# EAGLE design main (EAGLE 6.2)
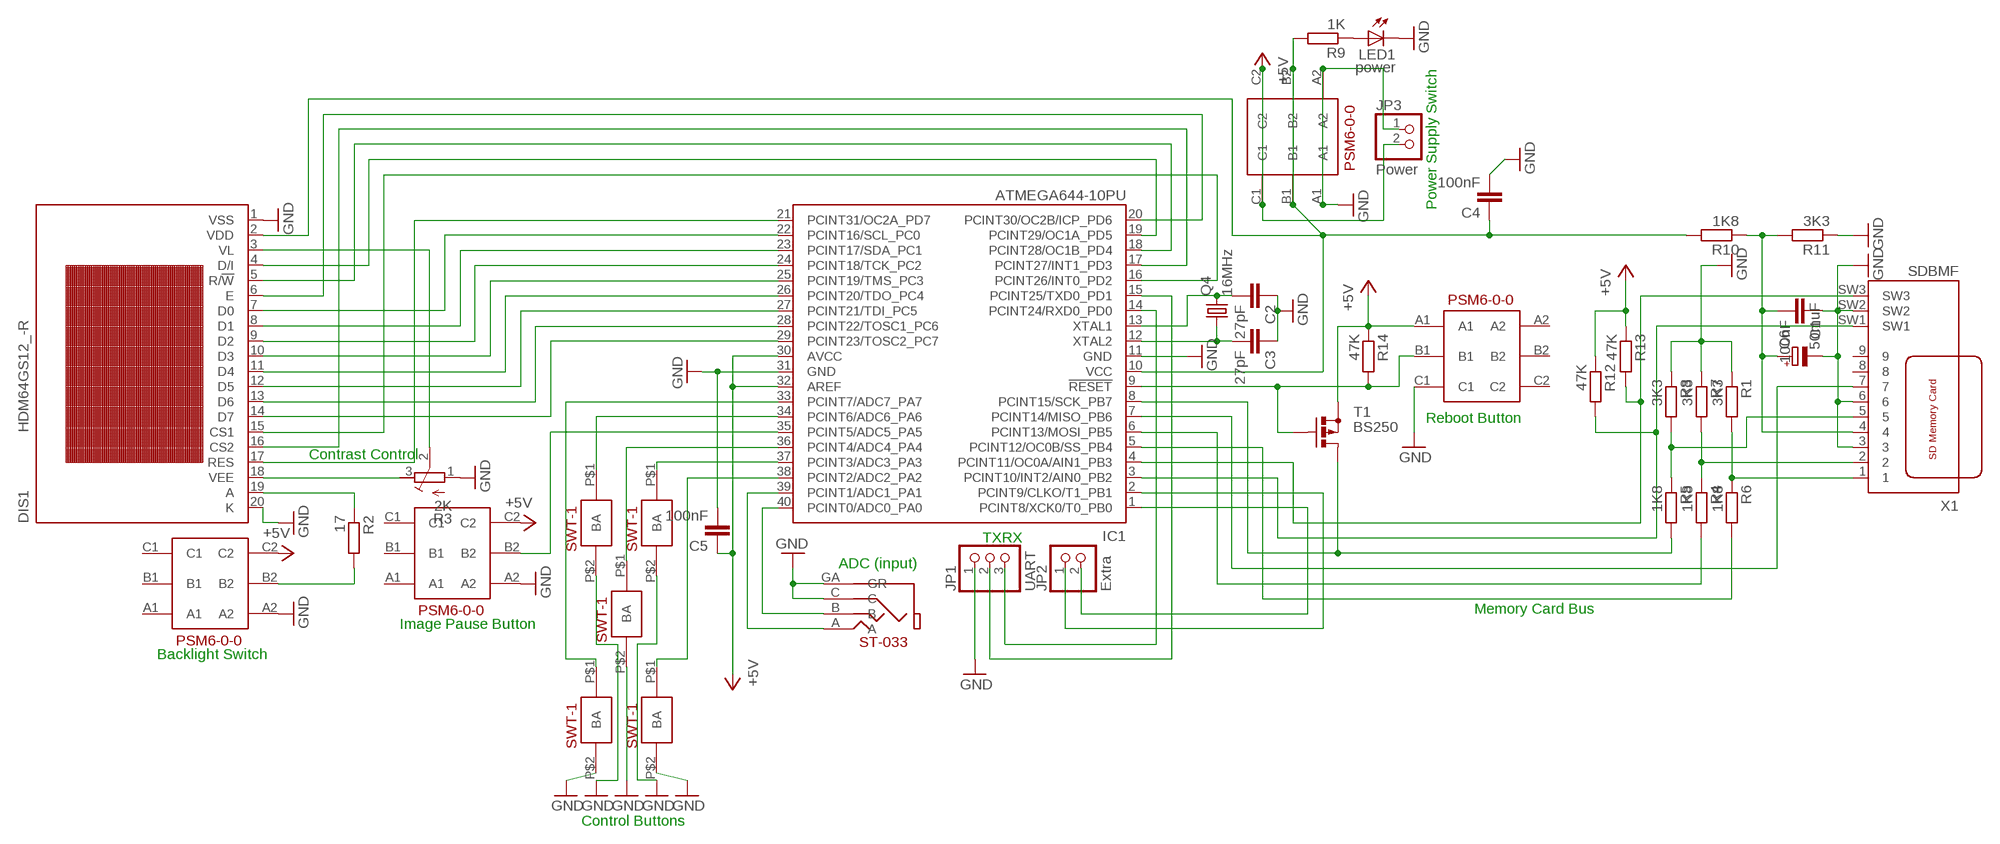
[diagram p0: schematic, sheet 1]

## Parts
C1  100nF  C-EU050-075X075  [C050-075X075]
C2  27pF  C-EU050-075X075  [C050-075X075]
C3  27pF  C-EU050-075X075  [C050-075X075]
C4  100nF  C-EU050-075X075  [C050-075X075]
C5  100nF  C-EU050-075X075  [C050-075X075]
C6  50muF  CPOL-EUE5-13  [E5-13]
DIS1  HDM64GS12_-R  [HDM64GS12_-R]
IC1  ATMEGA644-10PU  [DIL40]
JP1  UART  PINHD-1X3  [1X03]
JP2  Extra  PINHD-1X2  [1X02]
JP3  Power  PINHD-1X2  [1X02]
LED1  power  LED3MM  [LED3MM]
Q4  16MHz  CRYSTALHC49U-V  [HC49U-V]
R1  3K3  R-EU_0204/7  [0204/7]
R2  17  R-EU_0817/22  [P0817/22]
R3  2K  R-TRIMM4G/J  [RTRIM4G/J]
R4  1K8  R-EU_0204/7  [0204/7]
R5  1K8  R-EU_0204/7  [0204/7]
R6  1K8  R-EU_0204/7  [0204/7]
R7  3K3  R-EU_0204/7  [0204/7]
R8  3K3  R-EU_0204/7  [0204/7]
R9  1K  R-EU_0204/7  [0204/7]
R10  1K8  R-EU_0204/7  [0204/7]
R11  3K3  R-EU_0204/7  [0204/7]
R12  47K  R-EU_0204/7  [0204/7]
R13  47K  R-EU_0204/7  [0204/7]
R14  47K  R-EU_0204/7  [0204/7]
T1  BS250  [SOT54E]
U$1_TOP  TOP  SWT-1  [SWT-1]
U$2_RIGHT  RIGHT  SWT-1  [SWT-1]
U$3_LEFT  LEFT  SWT-1  [SWT-1]
U$4_BOTTOM  BOTTOM  SWT-1  [SWT-1]
U$5_CENTER  CENTER  SWT-1  [SWT-1]
U$6_BACKLIGHT  pause  PSM6-0-0  [PSM6-0-0]
U$6_PAUSE  pause  PSM6-0-0  [PSM6-0-0]
U$7_POWER  power  PSM6-0-0  [PSM6-0-0]
U$8_REBOOT  reboot  PSM6-0-0  [PSM6-0-0]
U$11  ST-033  [ST-033]
X1  SDBMF  [SDBMF-009XXBXX2]

## Nets
+5V: C5.1 IC1.30(AVCC) IC1.32(AREF) JP3.2 R12.1 R13.1 R14.1 T1.S U$6_BACKLIGHT.C2 U$6_PAUSE.C2 U$7_POWER.C1 U$7_POWER.C2 U$8_REBOOT.A1
GND: C1.1 C2.1 C3.1 C4.2 C5.2 C6.- DIS1.1(VSS) DIS1.20(K) IC1.11(GND) IC1.31(GND) JP1.1 JP3.1 LED1.K(C) R1.1 R3.1(E) R7.1 R8.1 R11.1 U$1_TOP.P$2(B) U$2_RIGHT.P$2(B) U$3_LEFT.P$2(B) U$4_BOTTOM.P$2(B) U$5_CENTER.P$2(B) U$6_BACKLIGHT.A2 U$6_PAUSE.A2 U$7_POWER.A1 U$7_POWER.A2 U$8_REBOOT.C1 U$11.C U$11.GA(GR) X1.3 X1.6 X1.SW2
N$1: DIS1.13(D6) IC1.28(PCINT22/TOSC1_PC6)
N$2: C2.2 IC1.13(XTAL1) Q4.2
N$3: DIS1.8(D1) IC1.23(PCINT17/SDA_PC1)
N$4: DIS1.9(D2) IC1.24(PCINT18/TCK_PC2)
N$5: DIS1.10(D3) IC1.25(PCINT19/TMS_PC3)
N$6: DIS1.11(D4) IC1.26(PCINT20/TDO_PC4)
N$7: DIS1.12(D5) IC1.27(PCINT21/TDI_PC5)
N$8: IC1.36(PCINT4/ADC4_PA4) U$3_LEFT.P$1(A)
N$9: DIS1.14(D7) IC1.29(PCINT23/TOSC2_PC7)
N$10: IC1.5(PCINT12/OC0B/SS_PB4) R6.2
N$11: DIS1.3(VL) R3.2(S)
N$12: DIS1.19(A) R2.1
N$13: LED1.A R9.1
N$14: DIS1.16(CS2) IC1.17(PCINT27/INT1_PD3)
N$15: DIS1.5(R/!W) IC1.18(PCINT28/OC1B_PD4)
N$16: DIS1.4(D/I) IC1.19(PCINT29/OC1A_PD5)
N$17: DIS1.15(CS1) IC1.16(PCINT26/INT0_PD2)
N$18: DIS1.17(RES) IC1.21(PCINT31/OC2A_PD7)
N$19: IC1.6(PCINT13/MOSI_PB5) R4.2
N$20: DIS1.6(E) IC1.20(PCINT30/OC2B/ICP_PD6)
N$21: IC1.4(PCINT11/OC0A/AIN1_PB3) R13.2 X1.SW3
N$22: R1.2 R6.1 X1.1
N$23: R4.1 R7.2 X1.2
N$24: R5.1 R8.2 X1.5
N$25: IC1.39(PCINT1/ADC1_PA1) U$11.A
N$26: DIS1.7(D0) IC1.22(PCINT16/SCL_PC0)
N$27: IC1.9(!RESET) R14.2 T1.G U$8_REBOOT.B1
N$28: C3.2 IC1.12(XTAL2) Q4.1
N$29: IC1.34(PCINT6/ADC6_PA6) U$1_TOP.P$1(A)
N$30: IC1.37(PCINT3/ADC3_PA3) U$2_RIGHT.P$1(A)
N$31: IC1.15(PCINT25/TXD0_PD1) JP1.2
N$32: IC1.33(PCINT7/ADC7_PA7) U$4_BOTTOM.P$1(A)
N$33: IC1.38(PCINT2/ADC2_PA2) U$5_CENTER.P$1(A)
N$34: IC1.40(PCINT0/ADC0_PA0) U$11.B
N$35: IC1.14(PCINT24/RXD0_PD0) JP1.3
N$36: IC1.35(PCINT5/ADC5_PA5) U$6_PAUSE.B2
N$37: DIS1.18(VEE) R3.3(A)
N$38: C1.2 C6.+ R10.1 R11.2 X1.4
N$39: IC1.7(PCINT14/MISO_PB6) X1.7
N$41: IC1.3(PCINT10/INT2/AIN0_PB2) R12.2 X1.SW1
N$42: R2.2 U$6_BACKLIGHT.B2
N$44: C4.1 DIS1.2(VDD) IC1.10(VCC) R9.2 R10.2 U$7_POWER.B1 U$7_POWER.B2
N$46: IC1.8(PCINT15/SCK_PB7) R5.2 T1.D
N$47: IC1.2(PCINT9/CLKO/T1_PB1) JP2.1
N$49: IC1.1(PCINT8/XCK0/T0_PB0) JP2.2
Unconnected: U$6_BACKLIGHT.A1 U$6_BACKLIGHT.B1 U$6_BACKLIGHT.C1 U$6_PAUSE.A1 U$6_PAUSE.B1 U$6_PAUSE.C1 U$8_REBOOT.A2 U$8_REBOOT.B2 U$8_REBOOT.C2 X1.8 X1.9

## Notes on the sheet
- Power Supply Switch
- Reboot Button
- Contrast Control
- TX | RX
- ADC (input)
- Memory Card Bus
- Image Pause Button
- Backlight Switch
- Control Buttons

## Library data of the parts
C1-C5 = resistor:C-EU: CAPACITOR, European symbol
C6 = resistor:CPOL-EU: POLARIZED CAPACITOR, European symbol
DIS1 = display-lcd:HDM64GS12_-R: HDM64GS12_-R 128 X 64 Dots Graphic Source: http://www.hantronix.com/down/64gs12-r.pdf; OC_FARNELL: unknown; OC_NEWARK: unknown
IC1 = atmel:ATMEGA644-*PU: 8-bit Microcontroller with 64K Bytes In-System Programmable Flash Auto generated by make-symbol-device-package-bsdl.ulp Rev. 34 Source: http://www.atmel.com/dyn/resources/prod_documents/doc2593.pdf; MPN: ATMEGA644V-10PU; OC_FARNELL: 1288342; OC_NEWARK: 23M5062
JP1 = pinhead:PINHD-1X3: PIN HEADER
JP2 JP3 = pinhead:PINHD-1X2: PIN HEADER
LED1 = led:LED: LED OSRAM: - CHIPLED LG R971, LG N971, LY N971, LG Q971, LY Q971, LO R971, LY R971 LH N974, LH R974 LS Q976, LO Q976, LY Q976 LO Q996 - Hyper CHIPLED LW Q18S LB Q993, LB Q99A, LB R99A - SideLED LS A670, LO A670, LY A670, LG A670, LP A670 LB A673, LV A673, LT A673, LW A673 LH A674 LY A675 LS A676, LA A676, LO A676, LY A676, LW A676 LS A679, LY A679, LG A679 - Hyper Micro SIDELED® LS Y876, LA Y876, LO Y876, LY Y876 LT Y87S - SmartLED LW L88C, LW L88S LB L89C, LB L89S, LG L890 LS L89K, LO L89K, LY L89K LS L896, LA L896, LO L896, LY L896 - TOPLED LS T670, LO T670, LY T670, LG T670, LP T670 LSG T670, LSP T670, LSY T670, LOP T670, LYG T670 LG T671, LOG T671, LSG T671 LB T673, LV T673, LT T673, LW T673 LH T674 LS T676, LA T676, LO T676, LY T676, LB T676, LH T676, LSB T676, LW T676 LB T67C, LV T67C, LT T67C, LS T67K, LO T67K, LY T67K, LW E67C LS E67B, LA E67B, LO E67B, LY E67B, LB E67C, LV E67C, LT E67C LW T67C LS T679, LY T679, LG T679 LS T770, LO T770, LY T770, LG T770, LP T770 LB T773, LV T773, LT T773, LW T773 LH T774 LS E675, LA E675, LY E675, LS T675 LS T776, LA T776, LO T776, LY T776, LB T776 LHGB T686 LT T68C, LB T68C - Hyper Mini TOPLED® LB M676 - Mini TOPLED Santana® LG M470 LS M47K, LO M47K, LY M47K Source: http://www.osram.convergy.de LUXEON: - LUMILED® LXK2-PW12-R00, LXK2-PW12-S00, LXK2-PW14-U00, LXK2-PW14-V00 LXK2-PM12-R00, LXK2-PM12-S00, LXK2-PM14-U00 LXK2-PE12-Q00, LXK2-PE12-R00, LXK2-PE12-S00, LXK2-PE14-T00, LXK2-PE14-U00 LXK2-PB12-K00, LXK2-PB12-L00, LXK2-PB12-M00, LXK2-PB14-N00, LXK2-PB14-P00, LXK2-PB14-Q00 LXK2-PR12-L00, LXK2-PR12-M00, LXK2-PR14-Q00, LXK2-PR14-R00 LXK2-PD12-Q00, LXK2-PD12-R00, LXK2-PD12-S00 LXK2-PH12-R00, LXK2-PH12-S00 LXK2-PL12-P00, LXK2-PL12-Q00, LXK2-PL12-R00 Source: www.luxeon.com KINGBRIGHT: KA-3528ASYC Source: www.kingbright.com
Q4 = crystal:CRYSTAL: CRYSTAL; OC_FARNELL: 1666969; OC_NEWARK: unknown
R1 R2 R4-R14 = resistor:R-EU_: RESISTOR, European symbol
R3 = resistor:R-TRIMM: Trimm resistor
T1 = transistor-small-signal:BS250: P-CHANNEL MOS FET
U$1_TOP U$2_RIGHT U$3_LEFT U$4_BOTTOM U$5_CENTER = SWT-1:SWT-1: SWT-1: Tact button, type 3. Electrical Characteristics: Operating Range: 12V, 50mA; Withstand voltage: 500V AC 1 min in TECH; The resistance of the insulator: At least 100 MW; Contact resistance: less than 0.1 ohm; performance Specifications; Number of cycles: 50 000
U$6_BACKLIGHT U$6_PAUSE U$7_POWER U$8_REBOOT = PSM6-0-0:PSM6-0-0: Electrical Characteristics: Operating current: 0.1A; Operating voltage: 12V; The resistance of the insulator: At least 100MoM; Contact resistance: 0.03 cM; Withstand voltage: 500V AC 1 min in TECH; performance Specifications: Number of cycles: at least 50,000;
U$11 = ST-033:ST-033
X1 = farnell:SDBMF: SD MEMORY CARD PUSH-PUSH WITH CONNECTOR TYPE B (BIG SWUÌTCH #3) KINGFONT PRECISION INDUSTIAL CO., LTD Source: http://www.farnell.com/datasheets/74273.pdf Best.-Nr.: 9186174 Hersteller: MULTICOMP Herstellerbez.: SDBMF-00915B0T2

## Board
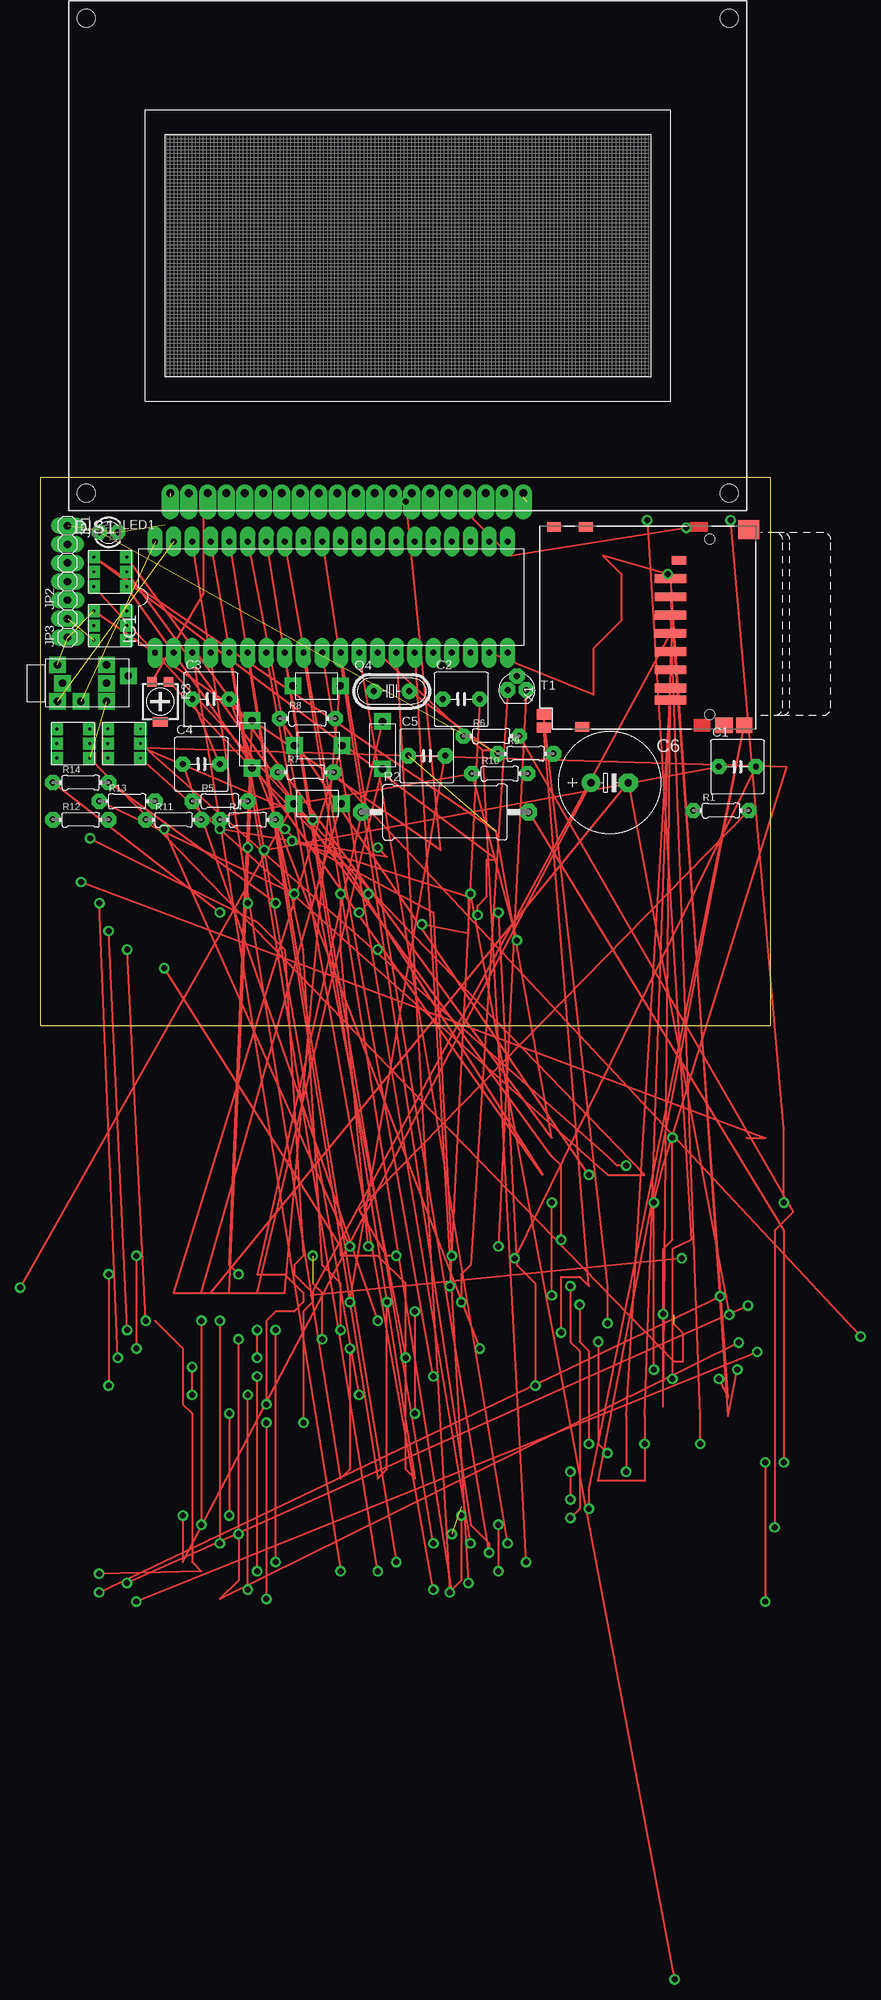
[diagram p1: board, top side]
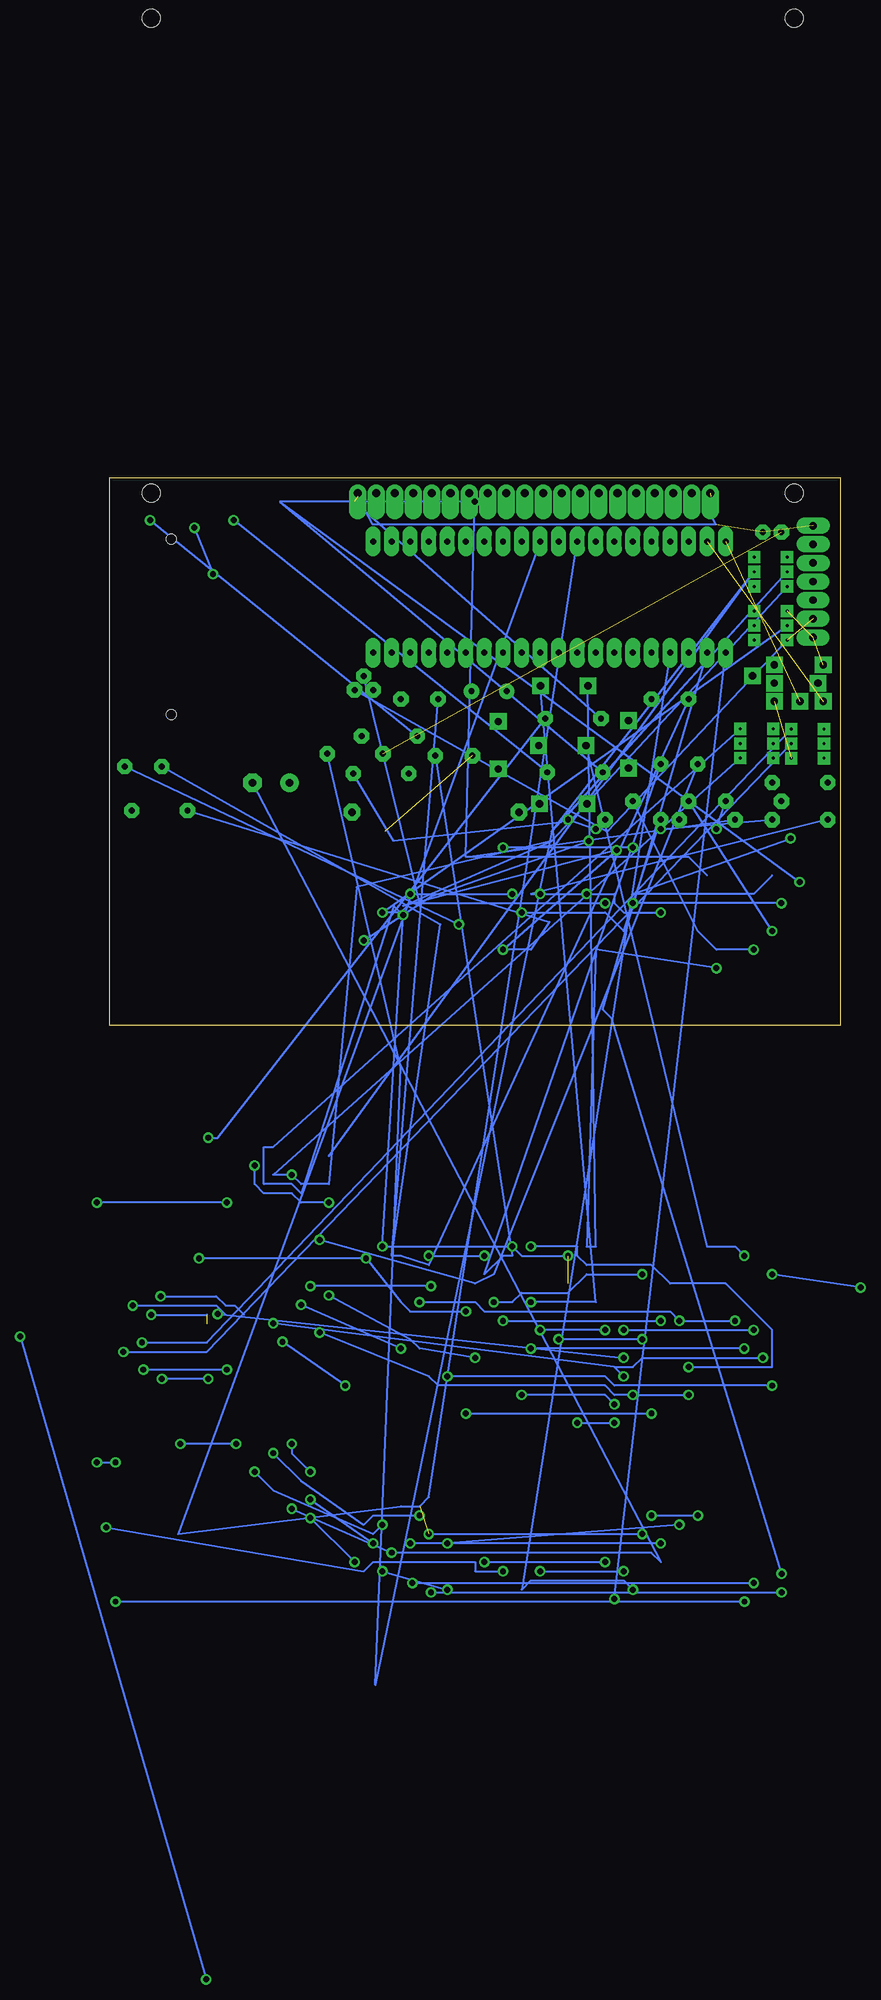
[diagram p2: board, bottom side, seen from below]

Size 100 x 75 mm. Coordinates in mm from the lower left corner, seen from the top.
Outline: 0,0 100,0 100,75 0,75 0,0
Copper layers (1*16): Top 0.035mm / dielectric 1.5mm / Bottom 0.035mm
Design rules: minimum track width 10mil, minimum drill 32mil, track to track 12mil, track to pad 12mil, pad to pad 12mil, via to via 12mil, smd to smd 8mil, copper to edge 40mil, drill to drill 40mil, minimum pad ring 25mil, minimum via ring 12mil, stop-mask expansion 4mil, vias tented up to drill 0mil, thermal gap 10mil

### Footprints (pad centres in the part's own frame; a part is rotated, then mirrored left to right if it is on the bottom)
C050-075X075 = drill 0.813 octagon: 1 -2.54,0; 2 2.54,0
E5-13 = drill 1.016 pad 2.54: + -2.54,0 | drill 1.016 pad 2.54 octagon: - 2.54,0
HDM64GS12_-R = drill 1.1 offset: 1 15.76,-32.5; 2 13.22,-32.5; 3 10.68,-32.5; 4 8.14,-32.5; 5 5.6,-32.5; 6 3.06,-32.5; 7 0.52,-32.5; 8 -2.02,-32.5; 9 -4.56,-32.5; 10 -7.1,-32.5; 11 -9.64,-32.5; 12 -12.18,-32.5; 13 -14.72,-32.5; 14 -17.26,-32.5; 15 -19.8,-32.5; 16 -22.34,-32.5; 17 -24.88,-32.5; 18 -27.42,-32.5; 19 -29.96,-32.5; 20 -32.5,-32.5 | hole 2.5: -44,-32.5; 44,-32.5; -44,32.5; 44,32.5
DIL40 = drill 0.813 long: 1 -24.13,-7.62; 2 -21.59,-7.62; 3 -19.05,-7.62; 4 -16.51,-7.62; 5 -13.97,-7.62; 6 -11.43,-7.62; 7 -8.89,-7.62; 8 -6.35,-7.62; 9 -3.81,-7.62; 10 -1.27,-7.62; 11 1.27,-7.62; 12 3.81,-7.62; 13 6.35,-7.62; 14 8.89,-7.62; 15 11.43,-7.62; 16 13.97,-7.62; 17 16.51,-7.62; 18 19.05,-7.62; 19 21.59,-7.62; 20 24.13,-7.62; 21 24.13,7.62; 22 21.59,7.62; 23 19.05,7.62; 24 16.51,7.62; 25 13.97,7.62; 26 11.43,7.62; 27 8.89,7.62; 28 6.35,7.62; 29 3.81,7.62; 30 1.27,7.62; 31 -1.27,7.62; 32 -3.81,7.62; 33 -6.35,7.62; 34 -8.89,7.62; 35 -11.43,7.62; 36 -13.97,7.62; 37 -16.51,7.62; 38 -19.05,7.62; 39 -21.59,7.62; 40 -24.13,7.62
1X03 = drill 1.016 long: 1 -2.54,0; 2 0,0; 3 2.54,0
1X02 = drill 1.016 long: 1 -1.27,0; 2 1.27,0
LED3MM = drill 0.813 octagon: A -1.27,0; K 1.27,0
HC49U-V = drill 0.813: 1 -2.413,0; 2 2.413,0
0204/7 = drill 0.813 octagon: 1 -3.81,0; 2 3.81,0
P0817/22 = drill 1.016 octagon: 1 -11.43,0; 2 11.43,0
RTRIM4G/J = smd 1.3 x 1.3: 1 -1.15,-2.75; 3 1.15,-2.75 | smd 2 x 1.3: 2 0,2.75
SOT54E = drill 0.813 octagon: D -1.27,0; G 0,1.905; S 1.27,0
SWT-1 = drill 1 square: P$1 0,3.25; P$2 0,-3.25
PSM6-0-0 = drill 0.4 pad 0.8 square: A1 -2.25,-2; A2 2.25,-2; B1 -2.25,0; B2 2.25,0; C1 -2.25,2; C2 2.25,2
ST-033 = drill 1 square: A 6.7,2.5; C 0,2.5; GA 6.7,-2.5; GC 0,-2.5 | drill 1 pad 2 square: B 3.5,2.5; P$6 6,0; P$8 0,0 | drill 1 pad 0.2 square: P$5 -3,-1
SDBMF-009XXBXX2 = smd 1.2 x 4.3: 1 6.7,5.325; 2 4.2,5.325; 3 1.7,5.325; 4 -0.8,5.325; 5 -3.3,5.325; 6 -5.8,5.325; 7 -8.3,5.325; 8 -9.925,5.325 | smd 1.2 x 2: 9 9.2,4.175 | smd 2.1 x 2.4: M1 -13.4,-2 | smd 2.6 x 2.9: M2 13.4,-5.35 | smd 1.3 x 1.9: M3 -13.6,17.4; M4 13.8,16.95; M5 13.8,21.3 | smd 1.4 x 1.95: SW1 -11.9,22.7; SW3 -13.7,22.7 | smd 2.1 x 2.2: SW2 -13.4,-4.75 | hole 1.4: -11.9,0; 12.1,0

### Placement (x,y rotation side)
C1  95.41,35.42 0 top
C2  57.61,44.66 0 top
C3  23.32,44.66 0 top
C4  22.05,35.77 0 top
C5  52.91,36.91 0 top
C6  77.93,33.23 0 top
DIS1  50.31,105.37 0 top
IC1  39.83,58.63 0 top
JP1  3.73,65.85 270 top
JP2  3.75,59.48 90 top
JP3  3.75,54.39 90 top
LED1  9.35,67.52 0 top
Q4  48.08,45.74 0 top
R1  93.17,29.42 0 top
R2  55.41,29.2 0 top
R3  16.42,44.31 180 top
R4  28.4,28.15 0 top
R5  24.59,30.69 0 top
R6  61.72,39.6 0 top
R7  36.32,34.65 0 top
R8  36.58,42.01 0 top
R9  66.42,37.19 0 top
R10  62.88,34.47 0 top
R11  18.24,28.15 0 top
R12  5.54,28.15 0 top
R13  11.89,30.69 0 top
R14  5.54,33.23 0 top
T1  65.23,45.93 0 top
U$1_TOP  37.81,46.46 90 top
U$2_RIGHT  46.83,38.35 0 top
U$3_LEFT  28.99,38.48 0 top
U$4_BOTTOM  37.94,30.35 90 top
U$5_CENTER  38.05,38.31 90 top
U$6_BACKLIGHT  4.5,38.57 0 top
U$6_PAUSE  11.46,38.59 0 top
U$7_POWER  9.56,62.09 0 top
U$8_REBOOT  9.56,54.72 0 top
U$11  9.05,46.85 180 top
X1  91.6,54.47 90 top

### Tracks (layer width: path | path; a pad name or v marks a point on that pad's centre or on a via)
+5V  (via drill 0.81)  (4 unrouted)
  Top 0.254: v34.75,17.99 R13.1 | v24.59,15.45 R14.1 | U$7_POWER.C2 70.01,-15.38 62.39,26.53 U$7_POWER.C1 62.39,22.72 61.12,22.72 61.12,17.64 59.85,16.37 v59.85,15.1 | T1.S v62.69,-30.27 | v41.1,17.99 41.1,10.37 v44.91,-30.27 | v95.59,-43.43 24.59,-78.53 27.13,-75.99 v27.13,-69.64 v27.13,-42.97 | 37.29,-35.35 38.56,-36.62 v38.56,-42.97
  Bottom 0.254: R12.1 42.37,17.99 v41.1,17.99 v34.75,17.99 30.94,17.99 30.94,16.72 29.67,15.45 v24.59,15.45 | T1.S 31.91,26.53 U$8_REBOOT.A1 | U$6_PAUSE.C2 77.63,-16.65 78.9,-16.65 78.9,-21.73 75.09,-21.73 73.82,-23 61.12,16.37 v59.85,15.1 v62.69,-30.27 v44.91,-30.27 43.64,-31.54 v37.29,-31.54 | v95.59,-43.43 86.7,-43.43 U$6_BACKLIGHT.C2 | v56.34,-69.64 v27.13,-69.64 | v27.13,-42.97 v38.56,-42.97 | IC1.32 56.34,-64.56 57.61,-65.83 60.15,-65.83 90.63,-69.64 IC1.30
GND  (via drill 0.81)  (8 unrouted)
  Top 0.254: 96.68,-15.38 99.22,-15.38 v5.59,19.63 | v50.04,71.7 54.77,23.99 U$8_REBOOT.C1 | IC1.11 v61.42,-72.18 61.42,-70.91 58.88,-68.37 IC1.31 | X1.6 82.71,-53.48 v82.71,-57.29 82.71,-62.37 76.36,-62.37 X1.SW2 75.09,-63.64 v75.09,-66.18 | v90.33,-57.29 90.33,-53.48 X1.3 | C4.2 C3.1 | U$7_POWER.A2 68.74,-20.46 39.53,25.26 U$7_POWER.A1 | R3.1 82.71,-20.46 77.63,-20.46 U$6_PAUSE.A2 | v30.64,23.99 C1.1 | 86.7,-40.89 87.97,-42.16 87.97,-45.97 86.7,-45.97 U$6_BACKLIGHT.A2 | 22.05,-36.62 18.24,-36.62 U$5_CENTER.P$2 | 22.05,-36.62 23.32,-36.62 | 23.32,-36.62 25.86,-36.62 | 22.05,-36.62 U$4_BOTTOM.P$2 | 25.86,-36.62 29.67,-36.62 | 25.86,-36.62 U$3_LEFT.P$2 | 29.67,-36.62 33.48,-36.62 U$1_TOP.P$2 | 29.67,-36.62 U$2_RIGHT.P$2 | 23.32,-36.62 C6.- v94.32,-39.62 | v42.37,-37.89 C5.2 | v75.09,-20.46 R8.1
  Bottom 0.254: 51.26,23.07 R11.1 | 51.26,23.07 20.78,23.07 18.24,20.53 | 66.55,71.7 R8.1 | 51.26,23.07 v50.04,71.7 66.55,71.7 | 76.71,71.7 R7.1 | 66.55,71.7 76.71,71.7 | 76.71,71.7 v5.59,19.63 | v82.71,-57.29 v90.33,-57.29 | v75.09,-66.18 v61.42,-72.18 25.86,-72.18 24.59,-73.45 C6.- | C4.2 48.72,-34.08 46.18,-31.54 44.91,-31.54 C5.2 | 61.42,-31.54 C2.1 | 61.42,-31.54 60.15,-31.54 56.34,-32.81 C3.1 | C1.1 54.77,13.83 61.42,-31.54 | 39.53,25.26 59.85,16.37 v30.64,23.99 v46.18,10.37 42.37,10.37 39.83,14.18 R1.1 | 39.53,25.26 66.2,18.91 70.01,-21.73 73.82,-21.73 v75.09,-20.46 77.63,-20.46 U$6_PAUSE.A2 | 39.53,25.26 U$7_POWER.A1 | v94.32,-39.62 86.7,-39.62 | v42.37,-37.89 33.48,-37.89 U$1_TOP.P$2 | 17.78,72.39 17.78,69.85 17.05,68.58 64.04,68.58 66.04,72.39 DIS1.1
N$2  (via drill 0.81)
  Top 0.254: v66.5,-73.45 60.53,37.64 | 60.53,37.64 IC1.13 | v72.55,-67.45 73.82,-66.18 73.82,-44.59 72.55,-43.32 v72.55,-35.7 | C2.2 v56.04,-35.7 | Q4.2 61.74,37.64 60.53,37.64
  Bottom 0.254: v72.55,-67.45 v66.5,-73.45 | v56.04,-35.7 v72.55,-35.7
N$8  (via drill 0.81)
  Top 0.254: U$3_LEFT.P$1 25.86,-32.81 v27.13,-34.08 | v47.45,-37.89 47.45,-60.75 46.18,-62.02 IC1.36
  Bottom 0.254: v27.13,-34.08 34.75,-34.08 37.29,-36.62 43.64,-36.62 44.91,-37.89 v47.45,-37.89
N$10  (via drill 0.81)
  Top 0.254: v46.18,-74.72 IC1.5 | v100.49,-68.72 100.49,-28.08 103.03,-25.54 R6.2
  Bottom 0.254: v46.18,-74.72 49.99,-74.72 49.99,-73.45 63.96,-73.45 65.23,-74.72 v100.49,-68.72
N$13  (1 unrouted)
N$16  (via drill 0.81)
  Top 0.254: v85.87,61.77 76.98,64.31 79.52,61.77 79.52,55.42 75.71,51.61 75.71,45.26 IC1.19 | v88.41,68.12 64.28,64.31 59.2,69.39 59.2,71.93 DIS1.4
  Bottom 0.254: v88.41,68.12 v85.87,61.77
N$19  (via drill 0.81)
  Top 0.254: R4.2 36.02,10.37 38.56,-32.81 41.1,-35.35 v41.1,-41.7 | v32.21,-73.45 v32.21,-41.7 | IC1.6 v48.72,-73.45
  Bottom 0.254: v32.21,-41.7 v41.1,-41.7 | v48.72,-73.45 v32.21,-73.45
N$21  (via drill 0.81)
  Top 0.254: v71.28,-42.05 71.28,-34.43 73.82,-34.43 75.09,-35.7 X1.SW3 | v28.4,-77.26 v28.4,-50.59 | v42.37,-30.27 v16.97,26.88 | v20.78,-50.59 v20.78,-46.78
  Bottom 0.254: v71.28,-42.05 56.34,-48.05 55.07,-49.32 32.21,-49.32 30.94,-50.59 v28.4,-50.59 v20.78,-50.59 | v28.4,-77.26 29.67,-75.99 42.37,-75.99 43.64,-77.26 IC1.4 | v16.97,26.88 R13.2 | v42.37,-30.27 36.02,-30.27 36.02,-31.54 34.75,-32.81 25.86,-32.81 23.32,-35.35 15.7,-35.35 9.35,-41.7 9.35,-46.78 v20.78,-46.78
N$22  (via drill 0.81)
  Top 0.254: R1.2 43.64,-25.19 47.45,-31.54 v48.72,-31.54 | v56.34,-31.54 53.8,15.45 34.75,25.61 v33.48,26.88 | v37.29,28.15 14.15,37.96 102.15,35.37 85.25,-19.19 v83.98,-24.27 v83.98,-47.13 | v95.41,-47.13 94.14,-53.48 X1.1 | v94.49,69.16 101.76,-14.11 v101.76,-24.27
  Bottom 0.254: v56.34,-31.54 v48.72,-31.54 | v37.29,28.15 v33.48,26.88 | v95.41,-47.13 v83.98,-47.13 | v94.49,69.16 R6.1 | v83.98,-24.27 v101.76,-24.27
N$23  (via drill 0.81)
  Top 0.254: v43.64,15.45 44.91,16.72 v44.91,17.99 | v86.82,-130.6 v58.88,17.99 | R7.2 v112.27,-42.6 | v92.87,-48.4 94.14,-50.94 X1.2 | v86.52,-48.4 86.52,-30.62 89.06,-29.35 v83.06,69.16
  Bottom 0.254: R4.1 29.67,12.91 32.21,15.45 v43.64,15.45 | v58.88,17.99 v44.91,17.99 | v112.27,-42.6 v86.82,-130.6 | v86.52,-48.4 v92.87,-48.4 | R7.2 v83.06,69.16
N$24  (via drill 0.81)
  Top 0.254: v11.89,-41.7 v9.35,12.91 | v29.67,-45.51 v29.67,-41.7 | X1.5 85.25,-52.21 v85.25,-39.51 85.25,-30.62 86.52,-29.35 v86.52,-15.38
  Bottom 0.254: v9.35,12.91 R5.1 | v29.67,-41.7 v11.89,-41.7 | v85.25,-39.51 v29.67,-45.51 | R8.2 85.25,-15.38 v86.52,-15.38
N$25  (1 unrouted)
N$27  (via drill 0.81)
  Top 0.254: v32.21,16.72 R14.2 | IC1.9 56.34,-77.26 57.61,-75.99 v57.61,-67.1 | v77.63,-58.56 76.36,-57.29 v76.36,-43.32 | v67.77,-49.32 67.77,-35.35 65.23,-32.81 v62.69,15.45
  Bottom 0.254: 57.61,16.72 v32.21,16.72 | U$8_REBOOT.B1 v62.69,15.45 60.15,15.45 58.88,16.72 57.61,16.72 | 57.61,16.72 T1.G | v57.61,-67.1 63.96,-67.1 65.23,-68.37 73.82,-62.37 v77.63,-58.56 | v67.77,-49.32 v76.36,-43.32
N$28  (via drill 0.81)
  Top 0.254: v63.96,-70.91 IC1.12 | v72.55,-61.1 v72.55,-64.91 | v75.09,-57.29 75.09,-44.59 73.82,-43.32 v73.82,-38.24 | C3.2 v60.15,-44.24
  Bottom 0.254: v72.55,-64.91 v63.96,-70.91 | v72.55,-61.1 75.09,-58.56 v75.09,-57.29 | v60.15,-44.24 v73.82,-38.24
N$29  (via drill 0.81)
  Top 0.254: v16.97,7.83 41.1,-30.27 41.1,-31.54 46.18,-31.54 49.99,-35.35 49.99,-60.75 51.26,-62.02 IC1.34
  Bottom 0.254: v16.97,7.83 33.48,10.37 34.75,-30.27 33.48,-30.27 U$1_TOP.P$1
N$30  (via drill 0.81)
  Top 0.254: v43.64,-50.59 IC1.37 | v30.94,-51.86 30.94,-40.43 32.21,-39.16 34.75,-39.16 36.02,-37.89 36.02,-36.62 33.48,-34.08 29.67,-34.08 U$2_RIGHT.P$1
  Bottom 0.254: v43.64,-50.59 32.21,-50.59 v30.94,-51.86
N$31  (via drill 0.81)
  Top 0.254: v11.86,-76.34 v96.86,-38.35 | IC1.15 v58.58,-76.34
  Bottom 0.254: 84.16,-39.62 85.43,-38.35 v96.86,-38.35 | v58.58,-76.34 v11.86,-76.34
N$32  (via drill 0.81)
  Top 0.254: v53.8,-48.05 IC1.33 | v9.35,-34.08 v9.35,-49.32 | U$4_BOTTOM.P$1 v-2.76,-35.89
  Bottom 0.254: v53.8,-48.05 32.21,-48.05 30.94,-49.32 v9.35,-49.32 | v-2.76,-35.89 v9.35,-34.08
N$33  (via drill 0.81)
  Top 0.254: IC1.38 41.1,-62.02 42.37,-60.75 v42.37,-44.24 | v13.16,-31.54 v13.16,-44.24
  Bottom 0.254: v13.16,-44.24 v42.37,-44.24 | v13.16,-31.54 14.43,-30.27 18.24,-30.27 U$5_CENTER.P$1
N$34  (1 unrouted)
N$35  (via drill 0.81)
  Top 0.254: v8.05,-77.61 v93.05,-37.08 | IC1.14 v56.04,-77.61
  Bottom 0.254: 81.62,-39.62 82.89,-38.35 84.16,-38.35 85.43,-37.08 v93.05,-37.08 | v56.04,-77.61 v8.05,-77.61
N$36  (via drill 0.81)
  Top 0.254: v80.17,-19.19 78.9,-19.19 77.63,-17.92 U$6_PAUSE.B2 | v70.01,-36.97 v70.01,-24.27 | IC1.35 v49.99,-45.51
  Bottom 0.254: v80.17,-19.19 80.17,-21.73 78.9,-23 75.09,-23 73.82,-24.27 v70.01,-24.27 | v70.01,-36.97 58.88,-42.97 57.61,-44.24 v49.99,-45.51
N$37
  Top 0.254: DIS1.18 22.37,71.93 22.37,59.23 R3.3
N$38  (via drill 0.81)
  Top 0.254: R11.2 R10.1 v65.23,11.64 | v52.23,13.83 58.58,12.56 58.58,17.64 v34.45,25.26 | v87.79,-31.89 36.99,-36.97 X1.4 | C1.2 v64.93,-31.89 | C6.+ 19.51,-73.45 v19.51,-67.1 | v25.86,-53.13 v25.86,-67.1 | v51.26,-39.16 v51.26,-53.13
  Bottom 0.254: v52.23,13.83 C1.2 | v34.45,25.26 56.04,17.64 v65.23,11.64 | v87.79,-31.89 v64.93,-31.89 60.15,-37.89 58.88,-39.16 v51.26,-39.16 | v25.86,-67.1 v19.51,-67.1 | v51.26,-53.13 v25.86,-53.13
N$39  (via drill 0.81)
  Top 0.254: v53.8,-77.26 IC1.7 | v62.69,-68.37 v62.69,-74.72 | v80.17,-61.1 80.17,-53.48 X1.7
  Bottom 0.254: v62.69,-74.72 v53.8,-77.26 | v62.69,-68.37 63.96,-69.64 77.63,-63.64 v80.17,-61.1
N$41  (via drill 0.81)
  Top 0.254: v77.63,-40.78 77.63,-35.7 X1.SW1 | v29.67,-74.72 v29.67,-48.05 | IC1.3 v41.1,-74.72 | v24.59,26.88 47.45,23.07 v46.18,24.34 | v28.4,16.72 v28.4,24.34 | v10.62,-45.51 v8.08,16.72
  Bottom 0.254: 30.94,-46.78 v77.63,-40.78 | v29.67,-48.05 30.94,-46.78 | v41.1,-74.72 v29.67,-74.72 | v24.59,26.88 R12.2 | v28.4,24.34 v46.18,24.34 | v8.08,16.72 v28.4,16.72 | v10.62,-45.51 27.13,-45.51 28.4,-46.78 30.94,-46.78
N$42  (via drill 0.81)
  Top 0.254: v13.13,-78.88 v98.13,-44.7 | v99.22,-59.83 v99.22,-78.88 | v101.76,-59.83 101.76,-28.08 R2.2
  Bottom 0.254: v98.13,-44.7 86.7,-44.7 U$6_BACKLIGHT.B2 | v99.22,-78.88 v13.13,-78.88 | v101.76,-59.83 v99.22,-59.83
N$44  (via drill 0.81)
  Top 0.254: v58.88,-70.91 IC1.10 | v24.59,-40.43 v24.59,-70.91 | C4.1 v46.18,-40.43 | v71.28,-29.35 71.28,-19.19 70.01,-17.92 U$7_POWER.B2
  Bottom 0.254: R9.2 60.2,-5.77 63.66,-90.31 39.53,26.53 | 39.53,26.53 U$7_POWER.B1 38.26,27.8 61.12,25.26 R10.2 | 39.53,26.53 U$7_POWER.B2 70.01,-17.92 | v24.59,-70.91 v58.88,-70.91 | v46.18,-40.43 v24.59,-40.43 | v71.28,-29.35 49.99,-35.35 47.45,-34.08 C4.1
N$46  (via drill 0.81)
  Top 0.254: v53.8,-70.91 IC1.8 | v22.05,-40.43 v22.05,-68.37 | v57.61,-37.89 57.61,-34.08 58.88,-32.81 T1.D | v14.43,-40.43 v11.89,10.37
  Bottom 0.254: v22.05,-68.37 v53.8,-70.91 | v57.61,-37.89 49.99,-37.89 48.72,-39.16 23.32,-39.16 v22.05,-40.43 v14.43,-40.43 | R5.2 19.51,12.91 16.97,10.37 v11.89,10.37
N$47  (via drill 0.81)
  Top 0.254: v8.05,-75.07 22.05,-74.72 20.78,-73.45 20.78,-53.13 19.51,-51.86 19.51,-44.24 15.7,-40.43
  Bottom 0.254: IC1.2 32.56,2.2 31.29,0.93 v8.05,-75.07
N$49  (via drill 0.81)
  Top 0.254: v30.94,-54.4 v30.94,-78.53 | v36.02,-54.4 36.02,-39.16 37.29,-37.89 37.29,-36.62 34.75,-34.08 34.75,-32.81 36.02,-31.54 33.48,10.37 29.67,14.18 v6.81,25.61
  Bottom 0.254: v30.94,-78.53 IC1.1 | v36.02,-54.4 v30.94,-54.4 | v6.81,25.61 28.4,17.99 11.89,17.99 9.35,20.53